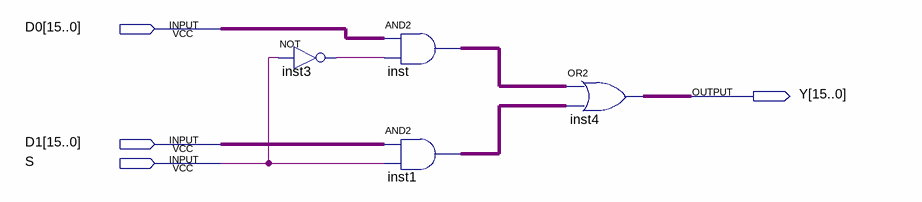
[diagram p0: schematic sheet]
// Quartus schematic MUX16_21.bdf as structural Verilog: 4 symbols, 4 pins
module MUX16_21 (
  input  [15:0] D0,
  input  [15:0] D1,
  input  S,
  output [15:0] Y
);

  wire inst3_out;
  wire [15:0] inst1_out, inst_out;

  not inst3 (inst3_out, S);
  assign inst_out = D0 & {16{inst3_out}};  // AND2 inst, 16 bits wide
  assign inst1_out = D1 & {16{S}};  // AND2 inst1, 16 bits wide
  assign Y = inst_out | inst1_out;  // OR2 inst4, 16 bits wide
endmodule
